# EAGLE design ESP8266_1wire_Gateway_NodeMCU_WeMosD1Mini_min (EAGLE 7.5.0)
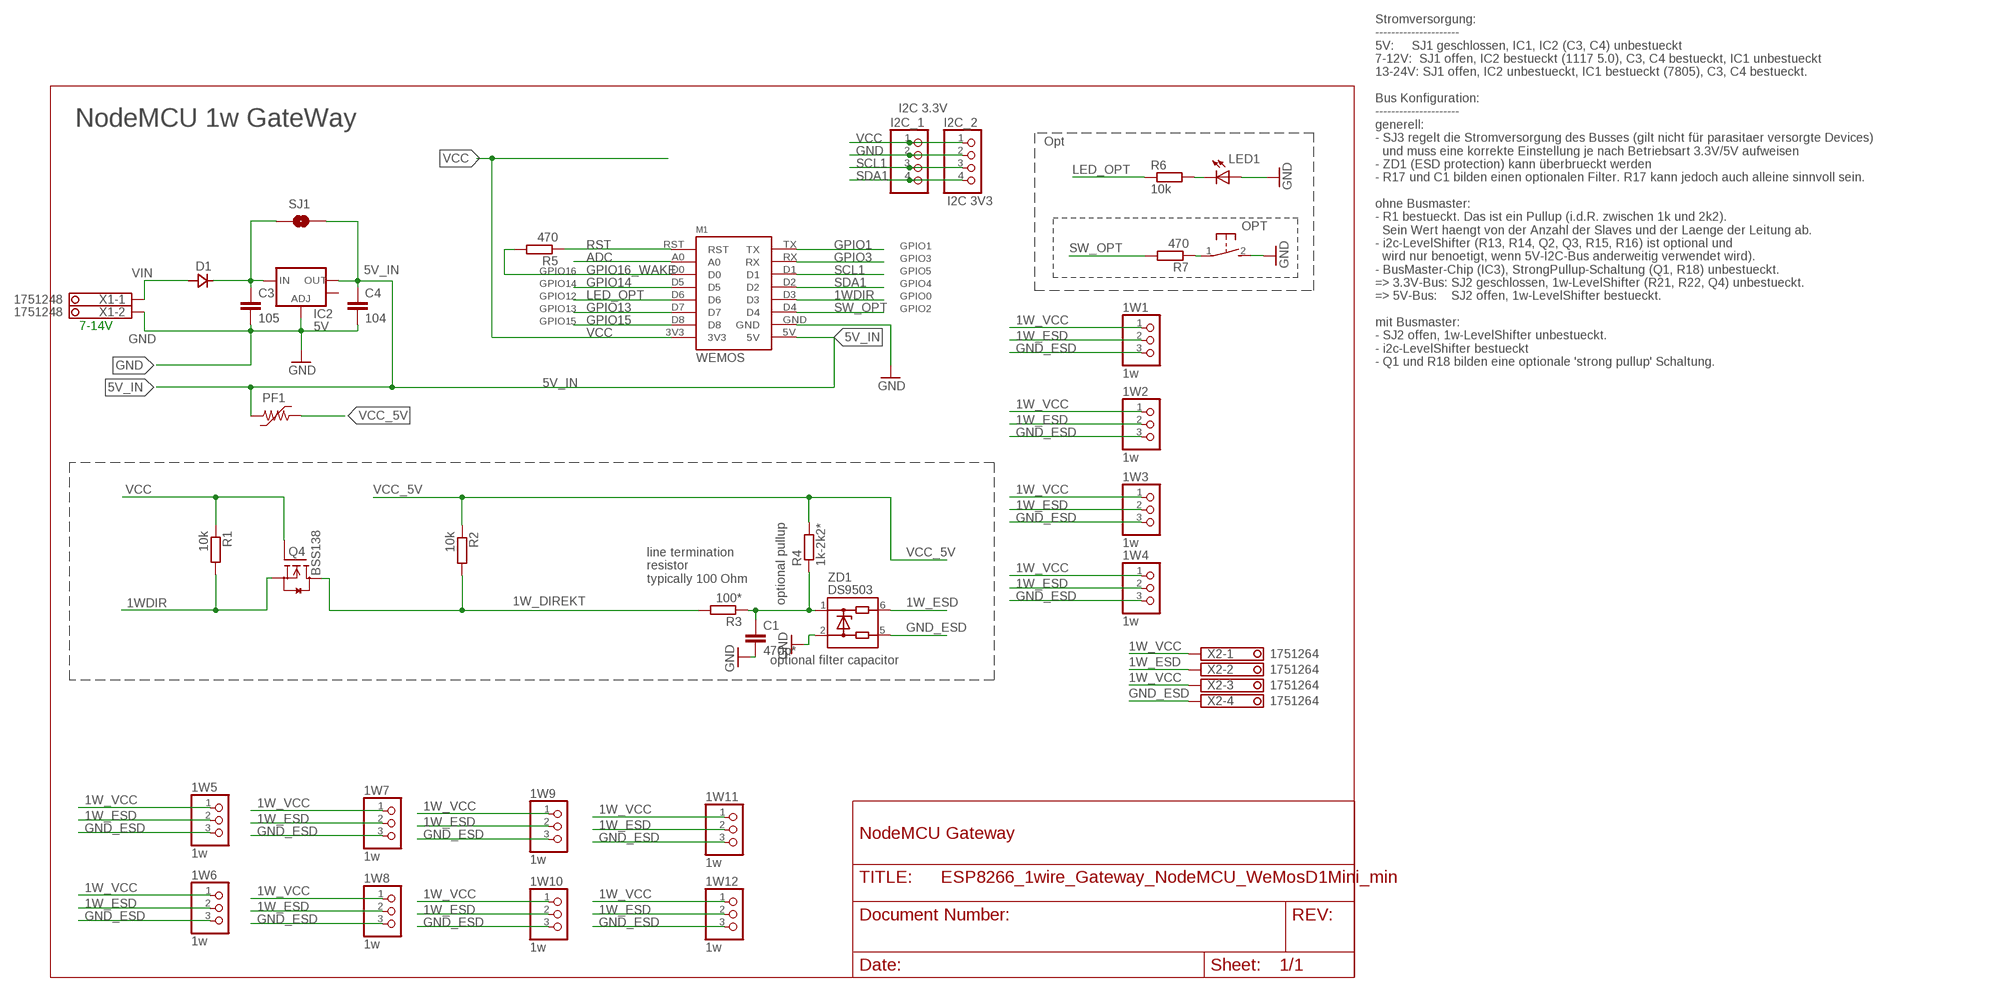
[diagram p0: schematic, sheet 1]

## Parts
1W1  1w  PINHD-1X3_S  [1X03]
1W2  1w  PINHD-1X3_S  [1X03]
1W3  1w  PINHD-1X3_S  [1X03]
1W4  1w  PINHD-1X3_S  [1X03]
1W5  1w  PINHD-1X3_S  [1X03]
1W6  1w  PINHD-1X3_S  [1X03]
1W7  1w  PINHD-1X3_S  [1X03]
1W8  1w  PINHD-1X3_S  [1X03]
1W9  1w  PINHD-1X3_S  [1X03]
1W10  1w  PINHD-1X3_S  [1X03]
1W11  1w  PINHD-1X3_S  [1X03]
1W12  1w  PINHD-1X3_S  [1X03]
C1  470p*  C-EUC0805  [C0805]
C3  105  C-EUC0805  [C0805]
C4  104  C-EUC0805  [C0805]
D1  SS14  [DO214]
I2C_1  PINHD-1X4_S  [1X04]
I2C_2  I2C 3V3  PINHD-1X4_S  [1X04]
IC2  5V  V_REG_LM1117SOT223  [SOT223]
LED1  CFG  LEDCHIPLED_1206  [CHIPLED_1206]
M1  WEMOS  [WEMOS]
OPT  OPT  DTSM-3  [DTSM-3]
PF1  500mA  PTC-F1206  [F1206]
Q4  BSS138  [SOT23]
R1  10k  R-EU_R0805  [R0805]
R2  10k  R-EU_R0805  [R0805]
R3  100*  R0805_SMALL_GAP  [R0805_SMALL_GAP]
R4  1k-2k2*  R-EU_R0805  [R0805]
R5  470  R-EU_R0805  [R0805]
R6  10k  R-EU_R0805  [R0805]
R7  470  R-EU_R0805  [R0805]
SJ1  bypass vreg  JUMPER-PAD-2-NOYES_SILK  [PAD-JUMPER-2-NO_YES_SILK]
X1  1751248  [1751248]
X2  1751264  [1751264]
ZD1  DS9503  DS9503_BYPASS_JP  [TSOC6_BYPASS_J]

## Nets
1W_: C1.1 R3.1 R4.1 ZD1.1
1W_DIREKT: Q4.3(D) R2.2 R3.2
1W_ESD: 1W1.2 1W2.2 1W3.2 1W4.2 1W5.2 1W6.2 1W7.2 1W8.2 1W9.2 1W10.2 1W11.2 1W12.2 X2.2 ZD1.6
1W_VCC: 1W1.1 1W2.1 1W3.1 1W4.1 1W5.1 1W6.1 1W7.1 1W8.1 1W9.1 1W10.1 1W11.1 1W12.1 X2.1 X2.3
1WDIR: M1.D3 Q4.2(S) R1.2
5V_IN: C4.1 IC2.2(OUT) M1.5V PF1.2 SJ1.2
ADC: M1.A0
GND: C1.2 C3.2 C4.2 I2C_1.2 I2C_2.2 IC2.1(ADJ) LED1.A M1.GND OPT.2 X1.2 ZD1.2
GND_ESD: 1W1.3 1W2.3 1W3.3 1W4.3 1W5.3 1W6.3 1W7.3 1W8.3 1W9.3 1W10.3 1W11.3 1W12.3 X2.4 ZD1.5
GPIO1: M1.TX
GPIO3: M1.RX
GPIO13: M1.D7
GPIO14: M1.D5
GPIO15: M1.D8
GPIO16_WAKE: M1.D0 R5.2
LED_OPT: M1.D6 R6.1
N$4: LED1.C R6.2
N$8: C3.1 D1.CATHODE IC2.3(IN) SJ1.1
N$11: OPT.1 R7.1
RST: M1.RST R5.1
SCL1: I2C_1.3 I2C_2.3 M1.D1
SDA1: I2C_1.4 I2C_2.4 M1.D2
SW_OPT: M1.D4 R7.2
VCC: I2C_1.1 I2C_2.1 M1.3V3 Q4.1(G) R1.1
VCC_5V: PF1.1 R2.1 R4.2
VIN: D1.ANODE X1.1
Unconnected: IC2.4(OUT)

## Notes on the sheet
- I2C 3.3V
- NodeMCU 1w GateWay
- Opt
- GPIO1
- GPIO3
- GPIO16 | GPIO5
- GPIO14 | GPIO4
- GPIO12 | GPIO0
- GPIO13 | GPIO2
- 7-14V
- GPIO15
- Stromversorgung:
  ---------------------
  5V:     SJ1 geschlossen, IC1, IC2 (C3, C4) unbestueckt
  7-12V:  SJ1 offen, IC2 bestueckt (1117 5.0), C3, C4 bestueckt, IC1 unbestueckt
  13-24V: SJ1 offen, IC2 unbestueckt, IC1 bestueckt (7805), C3, C4 bestueckt.
  
  Bus Konfiguration:
  ---------------------
  generell:
  - SJ3 regelt die Stromversorgung des Busses (gilt nicht für parasitaer versorgte Devices)
    und muss eine korrekte Einstellung je nach Betriebsart 3.3V/5V aufweisen
  - ZD1 (ESD protection) kann überbrueckt werden
  - R17 und C1 bilden einen optionalen Filter. R17 kann jedoch auch alleine sinnvoll sein.
  
  ohne Busmaster:
  - R1 bestueckt. Das ist ein Pullup (i.d.R. zwischen 1k und 2k2).  
    Sein Wert haengt von der Anzahl der Slaves und der Laenge der Leitung ab.
  - i2c-LevelShifter (R13, R14, Q2, Q3, R15, R16) ist optional und 
    wird nur benoetigt, wenn 5V-I2C-Bus anderweitig verwendet wird).
  - BusMaster-Chip (IC3), StrongPullup-Schaltung (Q1, R18) unbestueckt. 
  => 3.3V-Bus: SJ2 geschlossen, 1w-LevelShifter (R21, R22, Q4) unbestueckt. 
  => 5V-Bus:    SJ2 offen, 1w-LevelShifter bestueckt. 
  
  mit Busmaster:
  - SJ2 offen, 1w-LevelShifter unbestueckt. 
  - i2c-LevelShifter bestueckt
  - Q1 und R18 bilden eine optionale 'strong pullup' Schaltung.
- line termination 
  resistor 
  typically 100 Ohm
- optional pullup
- optional filter capacitor
- NodeMCU Gateway

## Library data of the parts
1W1-1W12 = my:PINHD-1X3_S: PIN HEADER
C1 C3 C4 = resistor:C-EU: CAPACITOR, European symbol
D1 = ihpcb-diode:SS14
I2C_1 I2C_2 = my:PINHD-1X4_S: PIN HEADER
IC2 = SparkFun-PowerIC:V_REG_LM1117: Voltage Regulator LM1117 Standard adjustable voltage regulator but in SMD form. Spark Fun Electronics SKU : COM-00595; PROD_ID: VREG-08170
LED1 = led:LED: LED OSRAM: - CHIPLED LG R971, LG N971, LY N971, LG Q971, LY Q971, LO R971, LY R971 LH N974, LH R974 LS Q976, LO Q976, LY Q976 LO Q996 - Hyper CHIPLED LW Q18S LB Q993, LB Q99A, LB R99A - SideLED LS A670, LO A670, LY A670, LG A670, LP A670 LB A673, LV A673, LT A673, LW A673 LH A674 LY A675 LS A676, LA A676, LO A676, LY A676, LW A676 LS A679, LY A679, LG A679 - Hyper Micro SIDELED® LS Y876, LA Y876, LO Y876, LY Y876 LT Y87S - SmartLED LW L88C, LW L88S LB L89C, LB L89S, LG L890 LS L89K, LO L89K, LY L89K LS L896, LA L896, LO L896, LY L896 - TOPLED LS T670, LO T670, LY T670, LG T670, LP T670 LSG T670, LSP T670, LSY T670, LOP T670, LYG T670 LG T671, LOG T671, LSG T671 LB T673, LV T673, LT T673, LW T673 LH T674 LS T676, LA T676, LO T676, LY T676, LB T676, LH T676, LSB T676, LW T676 LB T67C, LV T67C, LT T67C, LS T67K, LO T67K, LY T67K, LW E67C LS E67B, LA E67B, LO E67B, LY E67B, LB E67C, LV E67C, LT E67C LW T67C LS T679, LY T679, LG T679 LS T770, LO T770, LY T770, LG T770, LP T770 LB T773, LV T773, LT T773, LW T773 LH T774 LS E675, LA E675, LY E675, LS T675 LS T776, LA T776, LO T776, LY T776, LB T776 LHGB T686 LT T68C, LB T68C - Hyper Mini TOPLED® LB M676 - Mini TOPLED Santana® LG M470 LS M47K, LO M47K, LY M47K Source: http://www.osram.convergy.de LUXEON: - LUMILED® LXK2-PW12-R00, LXK2-PW12-S00, LXK2-PW14-U00, LXK2-PW14-V00 LXK2-PM12-R00, LXK2-PM12-S00, LXK2-PM14-U00 LXK2-PE12-Q00, LXK2-PE12-R00, LXK2-PE12-S00, LXK2-PE14-T00, LXK2-PE14-U00 LXK2-PB12-K00, LXK2-PB12-L00, LXK2-PB12-M00, LXK2-PB14-N00, LXK2-PB14-P00, LXK2-PB14-Q00 LXK2-PR12-L00, LXK2-PR12-M00, LXK2-PR14-Q00, LXK2-PR14-R00 LXK2-PD12-Q00, LXK2-PD12-R00, LXK2-PD12-S00 LXK2-PH12-R00, LXK2-PH12-S00 LXK2-PL12-P00, LXK2-PL12-Q00, LXK2-PL12-R00 Source: www.luxeon.com KINGBRIGHT: KA-3528ASYC Source: www.kingbright.com
M1 = 1455413453956-wemos:WEMOS
OPT = mechanics:DTSM-3: Diptronics SMD button 6x3.5 mm
PF1 = polyswitch:PTC-: POLYSWITCH Polyswitch Resetable Fuses
Q4 = my:BSS138: Fairchild Semiconductors BSS138 N-Channel Logic Level Enhancement Mode Field Effect Transistor General Description: These N-Channel enhancement mode field effect transistors are produced using Fairchild's proprietary, high cell density, DMOS technology. These products have been designed to minimize on-state resistance while provide rugged, reliable, and fast switching performance.These products are particularly suited for low voltage, low current applications such as small servo motor control, power MOSFET gate drivers, and other switching applications. Features: 0.22 A, 50 V. RDS(ON) = 3.5Ohm @ VGS = 10 V RDS(ON) = 6.0Ohm @ VGS = 4.5 V High density cell design for extremely low RDS(ON) Rugged and Reliable Compact industry standard SOT-23 surface mount package Please send any comments to: messi@users.sourceforge.net
R1 R2 R5 R7 = resistor:R-EU_: RESISTOR, European symbol
R3 = my:R0805_SMALL_GAP: SMD Resistor (0805) mit einer schmalleren Lücke (kann als Lötjumper erwendet werden)
R4 R6 = rcl:R-EU_: RESISTOR, European symbol
SJ1 = SparkFun-Passives:JUMPER-PAD-2-NO
X1 = con-phoenix-350:1751248: MKDS 1/ 2-3,5 Printklemme Nennstrom: 10 A Bemessungsspannung: 160 V Raster: 3,5 mm Polzahl: 2 Montageart: Löten Anschlussart: Schraubanschluss Anschlussrichtung vom Leiter zur Platine: 0° Source: http://eshop.phoenixcontact.com .. 1751248.pdf; OC_FARNELL: unknown; OC_NEWARK: unknown
X2 = con-phoenix-350:1751264: MKDS 1/ 4-3,5 Printklemme Nennstrom: 10 A Bemessungsspannung: 160 V Raster: 3,5 mm Polzahl: 4 Montageart: Löten Anschlussart: Schraubanschluss Anschlussrichtung vom Leiter zur Platine: 0° Source: http://eshop.phoenixcontact.com .. 1751264.pdf; MPN: 1751264; OC_FARNELL: unknown; OC_NEWARK: 10R0934
ZD1 = my:DS9503_BYPASS_J: ESD Protection Diode with Resistors This ESD protection diode is designed especially for onewire host interfaces. Unlike the DS9502, it has two additional 5Ohm resitors in the 1W and GND line. Pin 5 and 6 have to be connected to the host side, pin 1 und 2 to the network side. The 1W line is through pin 1 and 6, the GND line is through pin 2 and 5. Author: Jan Kandziora <jjj@gmx.de>

## Board
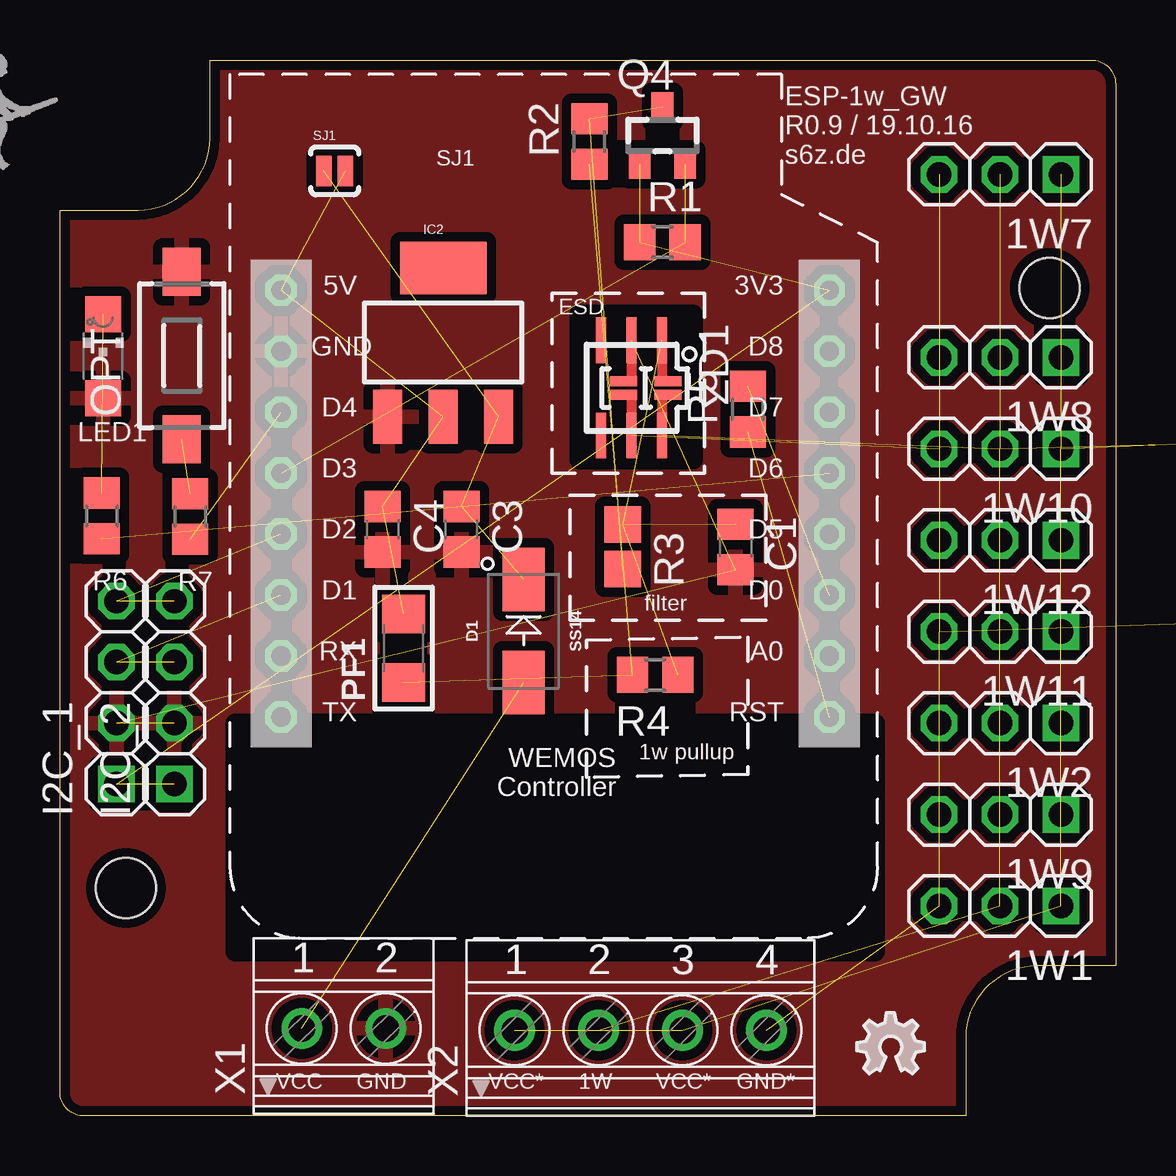
[diagram p1: board, top side]
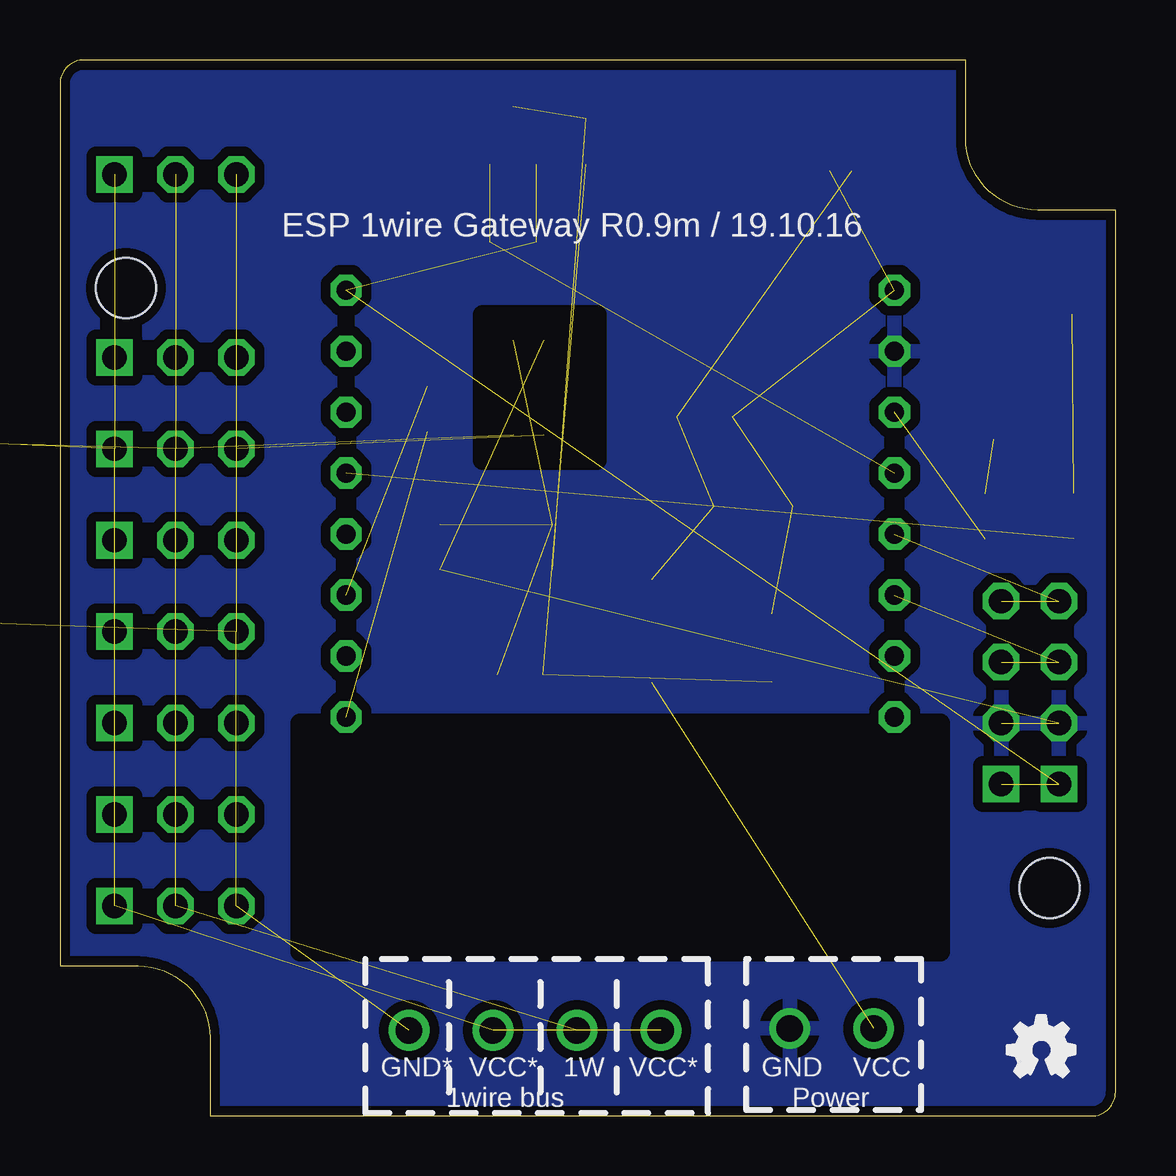
[diagram p2: board, bottom side, seen from below]

Size 44 x 44 mm. Coordinates in mm from the lower left corner, seen from the top.
Outline: 37.75,0 1,0 arc-90 0,1 0,37.75 3.25,37.75 arc90 6.25,40.75 6.25,44 43,44 arc-90 44,43 44,6.25 40.75,6.25 arc90 37.75,3.25 37.75,0
Copper layers (1*16): Top 0.035mm / dielectric 1.5mm / Bottom 0.035mm
Design rules "ITEADstudio_DRC *": minimum track width 16mil, minimum drill 12mil, track to track 6mil, track to pad 10mil, pad to pad 6mil, via to via 6mil, smd to smd 0mil, copper to edge 10mil, drill to drill 10mil, minimum pad ring 10mil, minimum via ring 6mil, stop-mask expansion 2mil, vias tented up to drill 100mil, thermal gap 16mil
Holes 2.5 mm at 41.25,34.5 2.75,9.5
tRestrict: area 7.3,6.8 to 34,16.4; area 21.6,27.3 to 26.4,33.4
bRestrict: area 7.3,6.8 to 34,16.4; area 21.6,27.3 to 26.4,33.4

### Footprints (pad centres in the part's own frame; a part is rotated, then mirrored left to right if it is on the bottom)
1X03 = drill 1.016 square: 1 -2.54,0 | drill 1.016 octagon: 2 0,0; 3 2.54,0
C0805 = smd 1.3 x 1.5: 1 -0.95,0; 2 0.95,0
DO214 = smd 2.65 x 1.75: ANODE -2.15,0; CATHODE 2.15,0
1X04 = drill 1.016 square: 1 -3.81,0 | drill 1.016 octagon: 2 -1.27,0; 3 1.27,0; 4 3.81,0
SOT223 = smd 1.219 x 2.235: 1 -2.311,-3.099; 2 0,-3.099; 3 2.311,-3.099 | smd 3.6 x 2.2: 4 0,3.099
CHIPLED_1206 = smd 1.5 x 1.5: A 0,-1.75; C 0,1.75
WEMOS = drill 0.8 octagon: 3V3 0,0; 5V 22.86,0; A0 0,15.24; D0 0,12.7; D1 22.86,12.7; D2 22.86,10.16; D3 22.86,7.62; D4 22.86,5.08; D5 0,10.16; D6 0,7.62; D7 0,5.08; D8 0,2.54; GND 22.86,2.54; RST 0,17.78; RX 22.86,15.24; TX 22.86,17.78
DTSM-3 = smd 2 x 1.6: 1 -3.494,0; 2 3.494,0
F1206 = smd 1.6 x 1.803: 1 -1.429,0; 2 1.429,0
SOT23 = smd 0.9 x 1.2: 1 -0.95,-1.2; 2 0.95,-1.2; 3 0,1.2
R0805 = smd 1.3 x 1.5: 1 -0.95,0; 2 0.95,0
R0805_SMALL_GAP = smd 1.524 x 1.524: 1 -0.927,0; 2 0.927,0
PAD-JUMPER-2-NO_YES_SILK = smd 0.635 x 1.27: 1 -0.45,0; 2 0.45,0
1751248 = drill 1.1 pad 1.7: 1 -1.75,-0.1; 2 1.75,-0.1
1751264 = drill 1.1 pad 1.7: 1 -5.25,-0.1; 2 -1.75,-0.1; 3 1.75,-0.1; 4 5.25,-0.1
TSOC6_BYPASS_J = smd 0.406 x 1.905: 1 -1.27,-1.981; 2 0,-1.981; 3 1.27,-1.981; 4 1.27,1.981; 5 0,1.981; 6 -1.27,1.981 | smd 1.143 x 0.406: 9 -1.524,-0.274; 10 -1.524,0.286; 11 0.33,-0.274; 12 0.33,0.286

### Placement (x,y rotation side)
1W1  39.19,8.75 180 top
1W2  39.19,16.37 180 top
1W3  53.23,35.37 0 top  (outside the outline)
1W4  53.11,28.18 0 top  (outside the outline)
1W5  53.08,20.82 0 top  (outside the outline)
1W6  53.23,12.28 0 top  (outside the outline)
1W7  39.19,39.23 180 top
1W8  39.19,31.61 180 top
1W9  39.19,12.56 180 top
1W10  39.19,27.8 180 top
1W11  39.19,20.18 180 top
1W12  39.19,23.99 180 top
C1  28.16,23.71 270 top
C3  16.73,24.45 270 top
C4  13.46,24.45 270 top
D1  19.32,20.21 90 top
I2C_1  2.36,17.64 90 top
I2C_2  4.77,17.64 90 top
IC2  15.97,32.23 0 top
LED1  1.8,31.66 0 top
M1  32.07,34.4 180 top
OPT  5.07,31.69 90 top
PF1  14.32,19.49 90 top
Q4  25.12,40.86 0 top
R1  25.12,36.41 0 top
R2  22.07,40.6 90 top
R3  23.46,23.71 270 top
R4  24.81,18.38 180 top
R5  28.67,29.45 90 top
R6  1.75,25.01 90 top
R7  5.43,24.98 270 top
SJ1  11.45,39.38 0 top
U$1  [OSHW_FILLX100_NOTEXT]  4.51,1.63 0 bottom
U$2  [OSHW_FILLX100_NOTEXT]  33.21,1.76 0 top
X1  11.83,3.75 0 top
X2  24.2,3.67 0 top
ZD1  23.82,30.34 180 top

### Tracks (layer width: path | path; a pad name or v marks a point on that pad's centre or on a via)
1W_  (3 unrouted)
1W_DIREKT  (2 unrouted)
1W_ESD  (13 unrouted)
1W_VCC  (13 unrouted)
1WDIR  (2 unrouted)
5V_IN  (4 unrouted)
GND  (3 unrouted)
  pour Top (isolate 0.406): -0.31,44.31 44.77,44.31 44.77,-0.46 -0.31,-0.46
  pour Bottom (isolate 0.406): -0.18,44.31 44.39,44.31 44.39,-0.14 -0.18,-0.14
GND_ESD  (13 unrouted)
GPIO16_WAKE  (1 unrouted)
LED_OPT  (1 unrouted)
N$4  (1 unrouted)
N$8  (3 unrouted)
N$11  (1 unrouted)
RST  (1 unrouted)
SCL1  (2 unrouted)
SDA1  (2 unrouted)
SW_OPT  (1 unrouted)
VCC  (4 unrouted)
VCC_5V  (2 unrouted)
VIN  (1 unrouted)

### Text on the board
tPlace: SJ1 | ESP-1w_GW / R0.9 / 19.10.16 / s6z.de | ESD | filter | 1w pullup | VCC | GND | VCC* | 1W | VCC* | GND*
bPlace: ESP 1wire Gateway R0.9m / 19.10.16 | VCC | GND | VCC* | 1W | VCC* | GND* | Power | 1wire bus